# Altium schematic sheet Port.SchDoc
size 127 x 177 mm; SheetNumber: 4; SheetTotal: 5
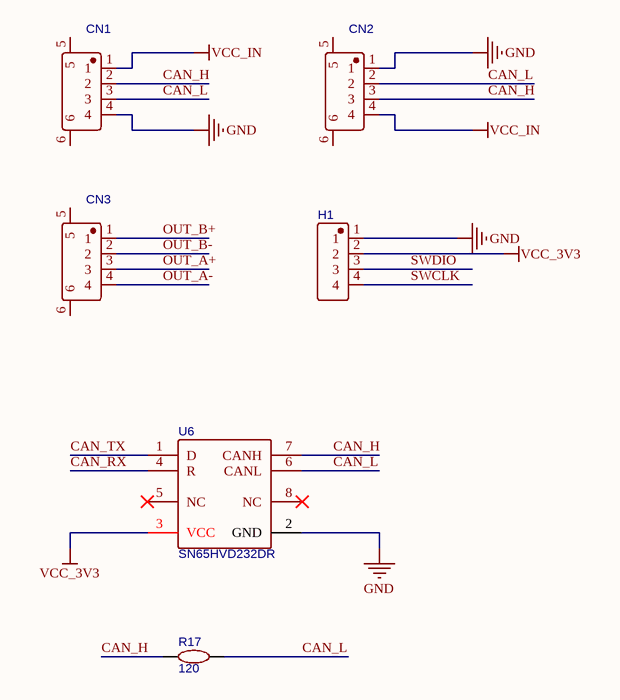
[diagram p0: Port.SchDoc]

## Parts
CN1  (no value)  [CONN-SMD_4P-P2.50-WAFER-254W-4P]
CN2  (no value)  [CONN-SMD_4P-P2.50-WAFER-254W-4P]
CN3  (no value)  [CONN-SMD_4P-P2.50-WAFER-254W-4P]
H1  (no value)  [HDR-TH_4P-P2.54-H-M-W10.4]
R17  120  [R0603]
U6  SN65HVD232DR  [SOIC-8_L5.0-W4.0-P1.27-LS6.0-BL]

## Nets
GND: CN1.4 CN2.1 H1.1 U6.2(GND)
VCC_3V3: H1.2 U6.3(VCC)
VCC_IN: CN1.1 CN2.4
CAN_H: CN1.2 CN2.3 R17.1 U6.7(CANH)
CAN_L: CN1.3 CN2.2 R17.2 U6.6(CANL)
CAN_RX: U6.4(R)
CAN_TX: U6.1(D)
OUT_A+: CN3.3
OUT_A-: CN3.4
OUT_B+: CN3.1
OUT_B-: CN3.2
SWCLK: H1.4
SWDIO: H1.3

Not connected (* = marked no-connect by the designer): CN1 5 6; CN2 5 6; CN3 5 6; U6 5(NC)* 8(NC)*

## Library data of the parts
CN1-CN3 = WAFER-254W-4P: BOM_Manufacturer: XUNPU(讯普); Contributor: LCSC; BOM_Supplier: LCSC; BOM_Supplier Part: C2856745; BOM_Manufacturer Part: WAFER-254W-4P; BOM_JLCPCB Part Class: Extended Part; spicePre: C; spiceSymbolName: WAFER-254W-4P
H1 = 2.54-1*4P反弯排针: BOM_Manufacturer: BOOMELE(博穆精密); Contributor: LCSC; BOM_Supplier: LCSC; BOM_Supplier Part: C91552; BOM_Manufacturer Part: 2.54-1*4P反弯排针; BOM_JLCPCB Part Class: Extended Part; spicePre: H; spiceSymbolName: 2.54-1*4P反弯排针
R17 = 120: BOM_Manufacturer: UniOhm; BOM_Manufacturer Part: 0603WAF1200T5E; nameAlias: Resistance (Ohms); BOM_Supplier: LCSC; BOM_Supplier Part: C22787; BOM_JLCPCB Part Class: Basic Part; spicePre: R; spiceSymbolName: 0603WAF1200T5E
U6 = SN65HVD232DR: BOM_Manufacturer: TI; BOM_Supplier: LCSC; BOM_Manufacturer Part: SN65HVD232DR; BOM_Supplier Part: C30530; BOM_JLCPCB Part Class: Extended Part; spicePre: U; spiceSymbolName: SN65HVD232DR